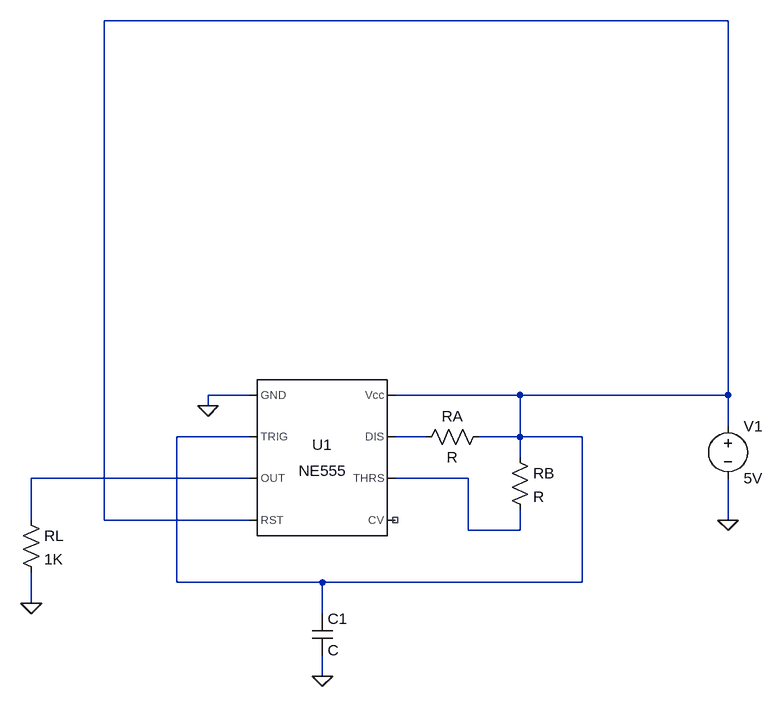
[diagram p0: schematic Draft1.asc]
Draft1.asc, the LTspice schematic file:
Version 4.1
SHEET 1 920 680
WIRE 864 -528 -96 -528
WIRE 128 48 64 48
WIRE 544 48 352 48
WIRE 864 48 864 -528
WIRE 864 48 544 48
WIRE 64 64 64 48
WIRE 864 96 864 48
WIRE 128 112 16 112
WIRE 400 112 352 112
WIRE 544 112 544 48
WIRE 544 112 480 112
WIRE 640 112 544 112
WIRE 544 144 544 112
WIRE 128 176 -208 176
WIRE 464 176 352 176
WIRE -208 240 -208 176
WIRE -96 240 -96 -528
WIRE 128 240 -96 240
WIRE 864 240 864 176
WIRE 464 256 464 176
WIRE 544 256 544 224
WIRE 544 256 464 256
WIRE 16 336 16 112
WIRE 240 336 16 336
WIRE 640 336 640 112
WIRE 640 336 240 336
WIRE -208 368 -208 320
WIRE 240 384 240 336
WIRE 240 480 240 448
FLAG 864 240 0
FLAG 64 64 0
FLAG 240 480 0
FLAG -208 368 0
SYMBOL Misc\\NE555 240 144 R0
SYMATTR InstName U1
SYMBOL voltage 864 80 R0
WINDOW 123 0 0 Left 0
WINDOW 39 0 0 Left 0
SYMATTR InstName V1
SYMATTR Value 5V
SYMBOL cap 224 384 R0
SYMATTR InstName C1
SYMBOL res 496 96 R90
WINDOW 0 0 56 VBottom 2
WINDOW 3 32 56 VTop 2
SYMATTR InstName RA
SYMBOL res 528 128 R0
SYMATTR InstName RB
SYMBOL res -224 224 R0
SYMATTR InstName RL
SYMATTR Value 1K

The netlist it stands for:
* Draft1.asc
X§U1 0 N001 N003 N001 NC_01 N004 N002 N001 NE555  ; pins GND TRIG OUT RST CV THRS DIS Vcc
V1 N001 0 5V
C1 N001 0 C
RA N001 N002 R
RB N001 N004 R
RL N003 0 1K
.lib NE555.sub
.backanno
.end